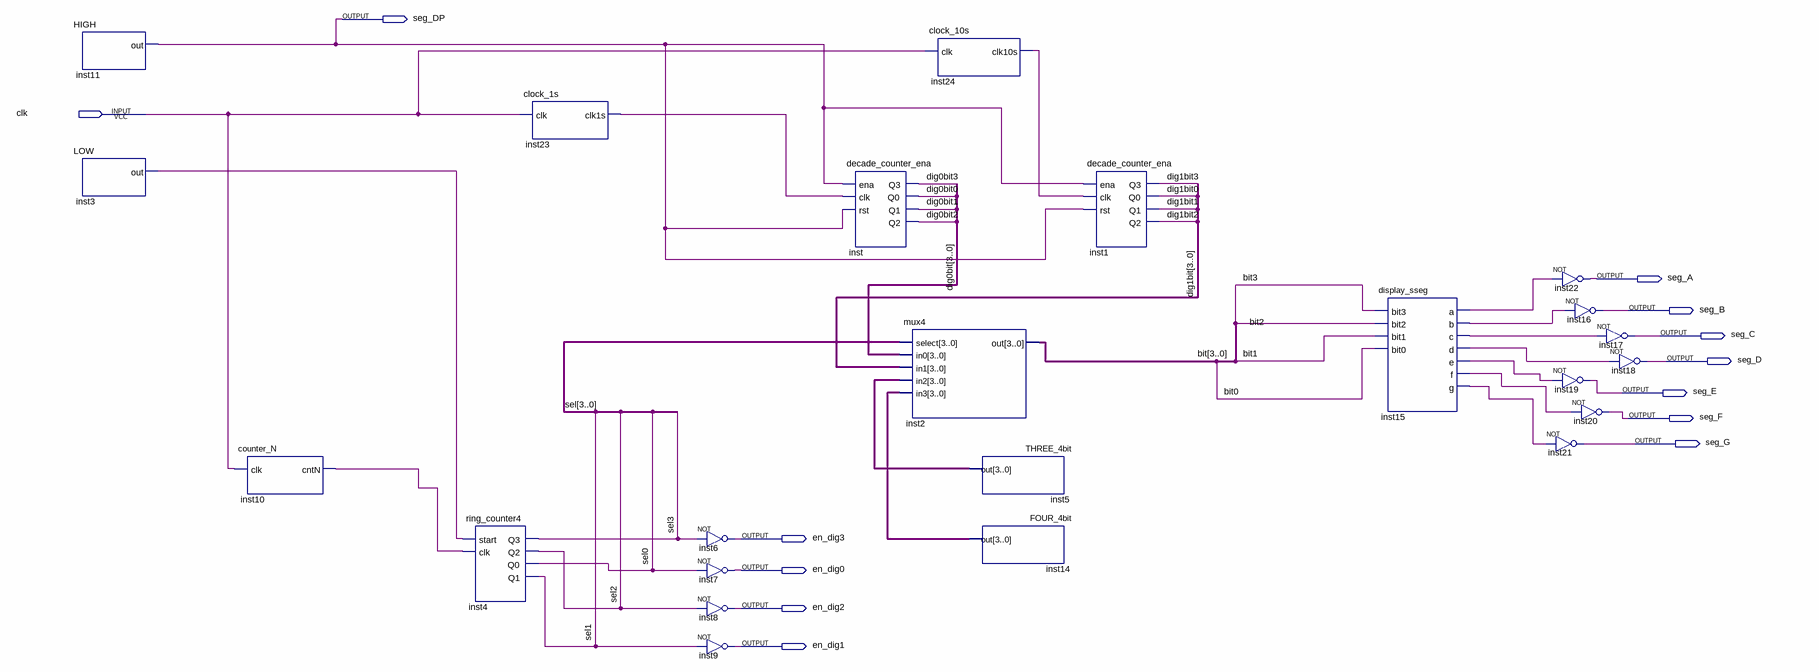
[diagram p0: schematic sheet]
// Quartus schematic test_2dig.bdf as structural Verilog: 23 symbols, 13 pins
module test_2dig (
  input  clk,
  output seg_DP,
  output seg_A,
  output seg_B,
  output seg_C,
  output seg_D,
  output seg_E,
  output seg_F,
  output seg_G,
  output en_dig3,
  output en_dig0,
  output en_dig2,
  output en_dig1
);

  wire inst3_out, inst10_cntn, inst15_a, inst15_b, inst15_c, inst15_d, inst15_e, inst15_f, inst15_g,
       inst23_clk1s, inst24_clk10s;
  wire [3:0] \bit , dig0bit, dig1bit, inst5_out, inst14_out, sel;

  HIGH inst11 (.out(seg_DP));
  LOW inst3 (.out(inst3_out));
  counter_N inst10 (.clk(clk), .cntN(inst10_cntn));
  ring_counter4 inst4 (.start(inst3_out), .clk(inst10_cntn), .Q3(sel[3]), .Q2(sel[2]), .Q0(sel[0]), .Q1(sel[1]));
  clock_1s inst23 (.clk(clk), .clk1s(inst23_clk1s));
  not inst6 (en_dig3, sel[3]);
  not inst7 (en_dig0, sel[0]);
  not inst8 (en_dig2, sel[2]);
  not inst9 (en_dig1, sel[1]);
  decade_counter_ena inst (
    .ena(seg_DP), .clk(inst23_clk1s), .rst(seg_DP), .Q3(dig0bit[3]), .Q0(dig0bit[0]), .Q1(dig0bit[1]),
    .Q2(dig0bit[2]));
  mux4 inst2 (.select(sel), .in0(dig0bit), .in1(dig1bit), .in2(inst5_out), .in3(inst14_out), .out(\bit ));
  clock_10s inst24 (.clk(clk), .clk10s(inst24_clk10s));
  THREE_4bit inst5 (.out(inst5_out));
  FOUR_4bit inst14 (.out(inst14_out));
  decade_counter_ena inst1 (
    .ena(seg_DP), .clk(inst24_clk10s), .rst(seg_DP), .Q3(dig1bit[3]), .Q0(dig1bit[0]), .Q1(dig1bit[1]),
    .Q2(dig1bit[2]));
  display_sseg inst15 (
    .bit3(\bit [3]), .bit2(\bit [2]), .bit1(\bit [1]), .bit0(\bit [0]), .a(inst15_a), .b(inst15_b),
    .c(inst15_c), .d(inst15_d), .e(inst15_e), .f(inst15_f), .g(inst15_g));
  not inst22 (seg_A, inst15_a);
  not inst16 (seg_B, inst15_b);
  not inst19 (seg_E, inst15_e);
  not inst20 (seg_F, inst15_f);
  not inst21 (seg_G, inst15_g);
  not inst17 (seg_C, inst15_c);
  not inst18 (seg_D, inst15_d);
endmodule
